# EAGLE design Usb check (EAGLE 9.5.0)

## Sheet 1 of 8
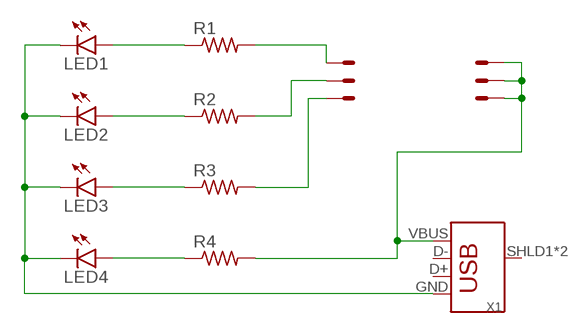
[diagram p0: schematic, sheet 1]

### Parts
LED1  LED5MM  [LED5MM]
LED2  LED5MM  [LED5MM]
LED3  LED5MM  [LED5MM]
LED4  LED5MM  [LED5MM]
R1  R-US_0207/10  [0207/10]
R2  R-US_0207/10  [0207/10]
R3  R-US_0207/10  [0207/10]
R4  R-US_0207/10  [0207/10]
X1  USB_A_PTH_MALE  [USB-A-H]
X2  22-23-2031  [22-23-2031]
X3  22-23-2031  [22-23-2031]

### Nets
GND: LED1.K(C) LED2.K(C) LED3.K(C) LED4.K(C) X1.GND
N$2: LED1.A R1.1
N$3: LED2.A R2.1
N$4: LED3.A R3.1
N$5: LED4.A R4.1
N$6: R1.2 X2.1
N$7: R2.2 X2.2
N$8: R3.2 X2.3
N$9: R4.2 X1.VBUS X3.1 X3.2 X3.3
Unconnected: X1.D+ X1.D- X1.SHLD1(SHIELD) X1.SHLD2(SHIELD)

## Sheet 2 of 8
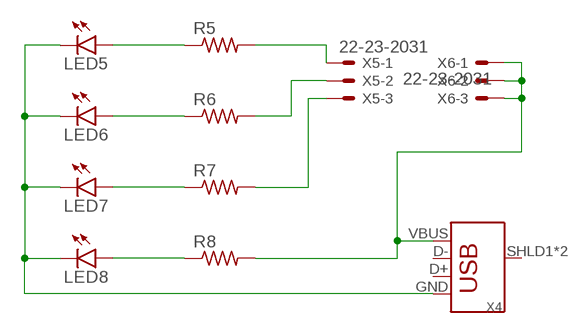
[diagram p1: schematic, sheet 2]

### Parts
LED5  LED5MM  [LED5MM]
LED6  LED5MM  [LED5MM]
LED7  LED5MM  [LED5MM]
LED8  LED5MM  [LED5MM]
R5  R-US_0207/10  [0207/10]
R6  R-US_0207/10  [0207/10]
R7  R-US_0207/10  [0207/10]
R8  R-US_0207/10  [0207/10]
X4  USB_A_PTH_MALE  [USB-A-H]
X5  22-23-2031  [22-23-2031]
X6  22-23-2031  [22-23-2031]

### Nets
GND1: LED5.K(C) LED6.K(C) LED7.K(C) LED8.K(C) X4.GND
N$1: LED5.A R5.1
N$10: LED6.A R6.1
N$11: LED7.A R7.1
N$12: LED8.A R8.1
N$13: R5.2 X5.1
N$14: R6.2 X5.2
N$15: R7.2 X5.3
N$16: R8.2 X4.VBUS X6.1 X6.2 X6.3
Unconnected: X4.D+ X4.D- X4.SHLD1(SHIELD) X4.SHLD2(SHIELD)

## Sheet 3 of 8
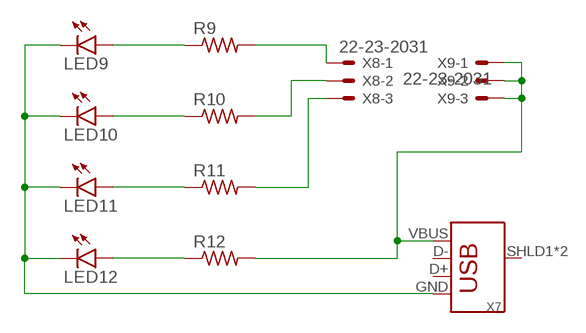
[diagram p2: schematic, sheet 3]

### Parts
LED9  LED5MM  [LED5MM]
LED10  LED5MM  [LED5MM]
LED11  LED5MM  [LED5MM]
LED12  LED5MM  [LED5MM]
R9  R-US_0207/10  [0207/10]
R10  R-US_0207/10  [0207/10]
R11  R-US_0207/10  [0207/10]
R12  R-US_0207/10  [0207/10]
X7  USB_A_PTH_MALE  [USB-A-H]
X8  22-23-2031  [22-23-2031]
X9  22-23-2031  [22-23-2031]

### Nets
GND2: LED9.K(C) LED10.K(C) LED11.K(C) LED12.K(C) X7.GND
N$17: LED9.A R9.1
N$18: LED10.A R10.1
N$19: LED11.A R11.1
N$20: LED12.A R12.1
N$21: R9.2 X8.1
N$22: R10.2 X8.2
N$23: R11.2 X8.3
N$24: R12.2 X7.VBUS X9.1 X9.2 X9.3
Unconnected: X7.D+ X7.D- X7.SHLD1(SHIELD) X7.SHLD2(SHIELD)

## Sheet 4 of 8
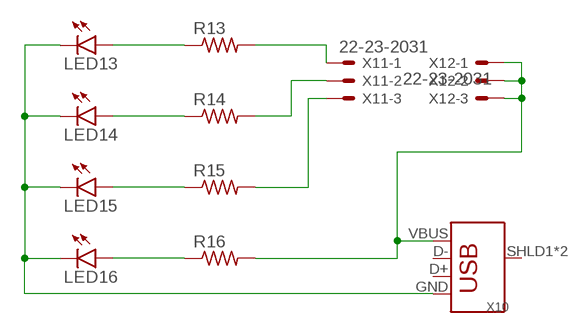
[diagram p3: schematic, sheet 4]

### Parts
LED13  LED5MM  [LED5MM]
LED14  LED5MM  [LED5MM]
LED15  LED5MM  [LED5MM]
LED16  LED5MM  [LED5MM]
R13  R-US_0207/10  [0207/10]
R14  R-US_0207/10  [0207/10]
R15  R-US_0207/10  [0207/10]
R16  R-US_0207/10  [0207/10]
X10  USB_A_PTH_MALE  [USB-A-H]
X11  22-23-2031  [22-23-2031]
X12  22-23-2031  [22-23-2031]

### Nets
GND3: LED13.K(C) LED14.K(C) LED15.K(C) LED16.K(C) X10.GND
N$25: LED13.A R13.1
N$26: LED14.A R14.1
N$27: LED15.A R15.1
N$28: LED16.A R16.1
N$29: R13.2 X11.1
N$30: R14.2 X11.2
N$31: R15.2 X11.3
N$32: R16.2 X10.VBUS X12.1 X12.2 X12.3
Unconnected: X10.D+ X10.D- X10.SHLD1(SHIELD) X10.SHLD2(SHIELD)

## Sheet 5 of 8
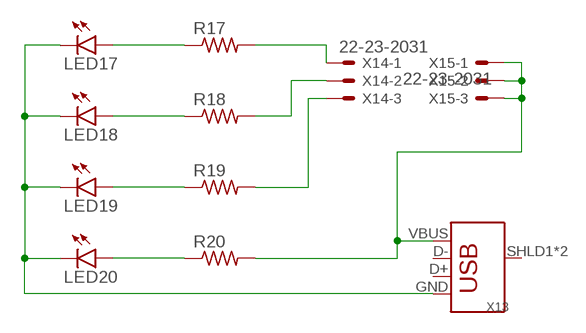
[diagram p4: schematic, sheet 5]

### Parts
LED17  LED5MM  [LED5MM]
LED18  LED5MM  [LED5MM]
LED19  LED5MM  [LED5MM]
LED20  LED5MM  [LED5MM]
R17  R-US_0207/10  [0207/10]
R18  R-US_0207/10  [0207/10]
R19  R-US_0207/10  [0207/10]
R20  R-US_0207/10  [0207/10]
X13  USB_A_PTH_MALE  [USB-A-H]
X14  22-23-2031  [22-23-2031]
X15  22-23-2031  [22-23-2031]

### Nets
GND4: LED17.K(C) LED18.K(C) LED19.K(C) LED20.K(C) X13.GND
N$33: LED17.A R17.1
N$34: LED18.A R18.1
N$35: LED19.A R19.1
N$36: LED20.A R20.1
N$37: R17.2 X14.1
N$38: R18.2 X14.2
N$39: R19.2 X14.3
N$40: R20.2 X13.VBUS X15.1 X15.2 X15.3
Unconnected: X13.D+ X13.D- X13.SHLD1(SHIELD) X13.SHLD2(SHIELD)

## Sheet 6 of 8
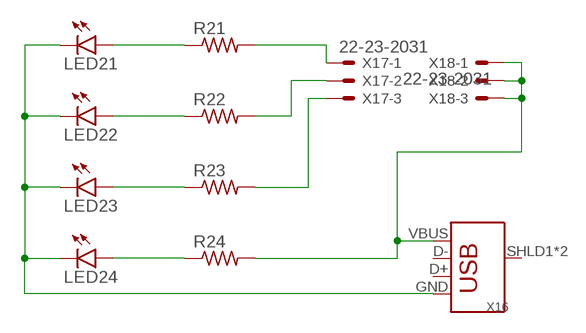
[diagram p5: schematic, sheet 6]

### Parts
LED21  LED5MM  [LED5MM]
LED22  LED5MM  [LED5MM]
LED23  LED5MM  [LED5MM]
LED24  LED5MM  [LED5MM]
R21  R-US_0207/10  [0207/10]
R22  R-US_0207/10  [0207/10]
R23  R-US_0207/10  [0207/10]
R24  R-US_0207/10  [0207/10]
X16  USB_A_PTH_MALE  [USB-A-H]
X17  22-23-2031  [22-23-2031]
X18  22-23-2031  [22-23-2031]

### Nets
GND5: LED21.K(C) LED22.K(C) LED23.K(C) LED24.K(C) X16.GND
N$41: LED21.A R21.1
N$42: LED22.A R22.1
N$43: LED23.A R23.1
N$44: LED24.A R24.1
N$45: R21.2 X17.1
N$46: R22.2 X17.2
N$47: R23.2 X17.3
N$48: R24.2 X16.VBUS X18.1 X18.2 X18.3
Unconnected: X16.D+ X16.D- X16.SHLD1(SHIELD) X16.SHLD2(SHIELD)

## Sheet 7 of 8
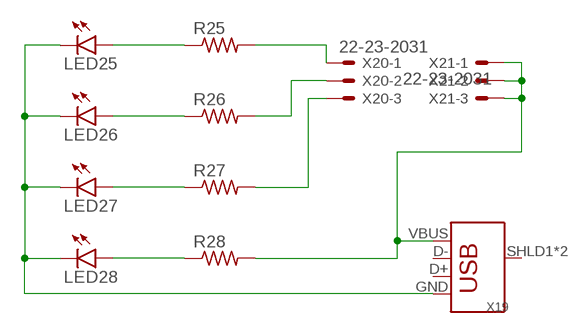
[diagram p6: schematic, sheet 7]

### Parts
LED25  LED5MM  [LED5MM]
LED26  LED5MM  [LED5MM]
LED27  LED5MM  [LED5MM]
LED28  LED5MM  [LED5MM]
R25  R-US_0207/10  [0207/10]
R26  R-US_0207/10  [0207/10]
R27  R-US_0207/10  [0207/10]
R28  R-US_0207/10  [0207/10]
X19  USB_A_PTH_MALE  [USB-A-H]
X20  22-23-2031  [22-23-2031]
X21  22-23-2031  [22-23-2031]

### Nets
GND6: LED25.K(C) LED26.K(C) LED27.K(C) LED28.K(C) X19.GND
N$49: LED25.A R25.1
N$50: LED26.A R26.1
N$51: LED27.A R27.1
N$52: LED28.A R28.1
N$53: R25.2 X20.1
N$54: R26.2 X20.2
N$55: R27.2 X20.3
N$56: R28.2 X19.VBUS X21.1 X21.2 X21.3
Unconnected: X19.D+ X19.D- X19.SHLD1(SHIELD) X19.SHLD2(SHIELD)

## Sheet 8 of 8
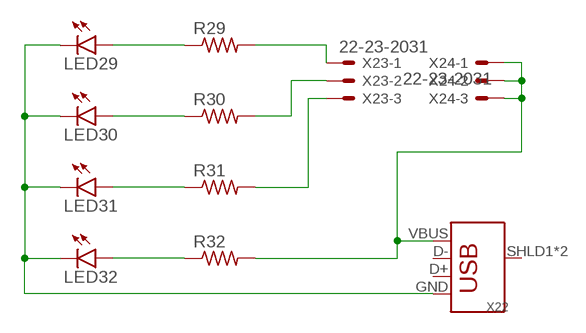
[diagram p7: schematic, sheet 8]

### Parts
LED29  LED5MM  [LED5MM]
LED30  LED5MM  [LED5MM]
LED31  LED5MM  [LED5MM]
LED32  LED5MM  [LED5MM]
R29  R-US_0207/10  [0207/10]
R30  R-US_0207/10  [0207/10]
R31  R-US_0207/10  [0207/10]
R32  R-US_0207/10  [0207/10]
X22  USB_A_PTH_MALE  [USB-A-H]
X23  22-23-2031  [22-23-2031]
X24  22-23-2031  [22-23-2031]

### Nets
GND7: LED29.K(C) LED30.K(C) LED31.K(C) LED32.K(C) X22.GND
N$57: LED29.A R29.1
N$58: LED30.A R30.1
N$59: LED31.A R31.1
N$60: LED32.A R32.1
N$61: R29.2 X23.1
N$62: R30.2 X23.2
N$63: R31.2 X23.3
N$64: R32.2 X22.VBUS X24.1 X24.2 X24.3
Unconnected: X22.D+ X22.D- X22.SHLD1(SHIELD) X22.SHLD2(SHIELD)

## Library data of the parts
LED1-LED32 = led:LED: LED OSRAM: - CHIPLED LG R971, LG N971, LY N971, LG Q971, LY Q971, LO R971, LY R971 LH N974, LH R974 LS Q976, LO Q976, LY Q976 LO Q996 - Hyper CHIPLED LW Q18S LB Q993, LB Q99A, LB R99A - SideLED LS A670, LO A670, LY A670, LG A670, LP A670 LB A673, LV A673, LT A673, LW A673 LH A674 LY A675 LS A676, LA A676, LO A676, LY A676, LW A676 LS A679, LY A679, LG A679 - Hyper Micro SIDELED® LS Y876, LA Y876, LO Y876, LY Y876 LT Y87S - SmartLED LW L88C, LW L88S LB L89C, LB L89S, LG L890 LS L89K, LO L89K, LY L89K LS L896, LA L896, LO L896, LY L896 - TOPLED LS T670, LO T670, LY T670, LG T670, LP T670 LSG T670, LSP T670, LSY T670, LOP T670, LYG T670 LG T671, LOG T671, LSG T671 LB T673, LV T673, LT T673, LW T673 LH T674 LS T676, LA T676, LO T676, LY T676, LB T676, LH T676, LSB T676, LW T676 LB T67C, LV T67C, LT T67C, LS T67K, LO T67K, LY T67K, LW E67C LS E67B, LA E67B, LO E67B, LY E67B, LB E67C, LV E67C, LT E67C LW T67C LS T679, LY T679, LG T679 LS T770, LO T770, LY T770, LG T770, LP T770 LB T773, LV T773, LT T773, LW T773 LH T774 LS E675, LA E675, LY E675, LS T675 LS T776, LA T776, LO T776, LY T776, LB T776 LHGB T686 LT T68C, LB T68C - Hyper Mini TOPLED® LB M676 - Mini TOPLED Santana® LG M470 LS M47K, LO M47K, LY M47K Source: http://www.osram.convergy.de LUXEON: - LUMILED® LXK2-PW12-R00, LXK2-PW12-S00, LXK2-PW14-U00, LXK2-PW14-V00 LXK2-PM12-R00, LXK2-PM12-S00, LXK2-PM14-U00 LXK2-PE12-Q00, LXK2-PE12-R00, LXK2-PE12-S00, LXK2-PE14-T00, LXK2-PE14-U00 LXK2-PB12-K00, LXK2-PB12-L00, LXK2-PB12-M00, LXK2-PB14-N00, LXK2-PB14-P00, LXK2-PB14-Q00 LXK2-PR12-L00, LXK2-PR12-M00, LXK2-PR14-Q00, LXK2-PR14-R00 LXK2-PD12-Q00, LXK2-PD12-R00, LXK2-PD12-S00 LXK2-PH12-R00, LXK2-PH12-S00 LXK2-PL12-P00, LXK2-PL12-Q00, LXK2-PL12-R00 Source: www.luxeon.com KINGBRIGHT: KA-3528ASYC Source: www.kingbright.com
R1-R32 = rcl:R-US_: RESISTOR, American symbol; SPICEPREFIX: R
X1 X4 X7 X10 X13 X16 X19 X22 = SparkFun-Connectors:USB_A: USB-A Connector Male and female variants, as well as PTH and SMT variants SparkFun Products: SparkFun XBee Explorer Dongle <https://www.sparkfun.com/products/11697> PTH Male SparkFun MicroView-USB Programmer <https://www.sparkfun.com/products/12924> SMT Male SparkFun USB Type A Female Breakout <https://www.sparkfun.com/products/12700> SMT Female; PROD_ID: CONN-08367; SF_ID: PRT-00437
X2 X3 X5 X6 X8 X9 X11 X12 X14 X15 X17 X18 X20 X21 X23 X24 = con-molex:22-23-2031: .100" (2.54mm) Center Header - 3 Pin; MF: MOLEX; MPN: 22-23-2031; OC_FARNELL: 1462950; OC_NEWARK: 30C0862

## Board
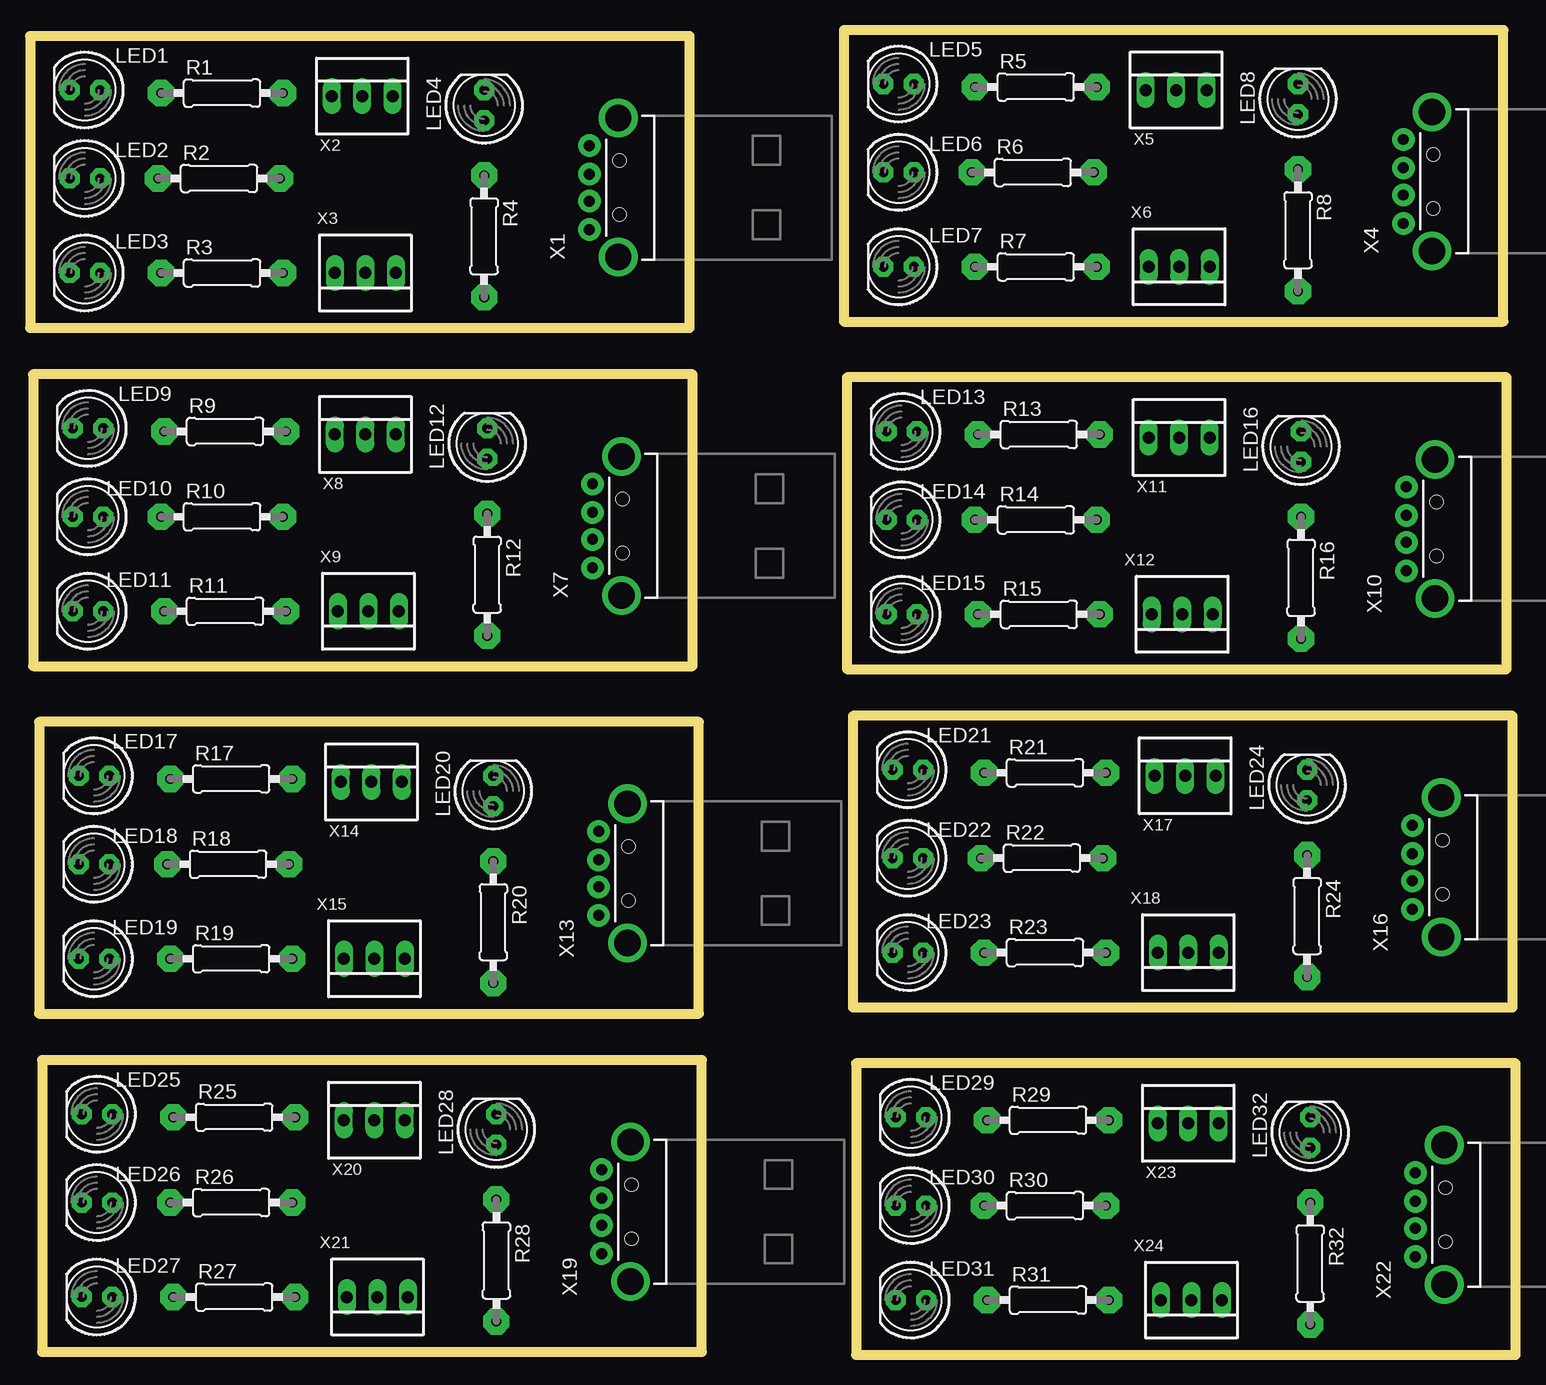
[diagram p8: board, top side]
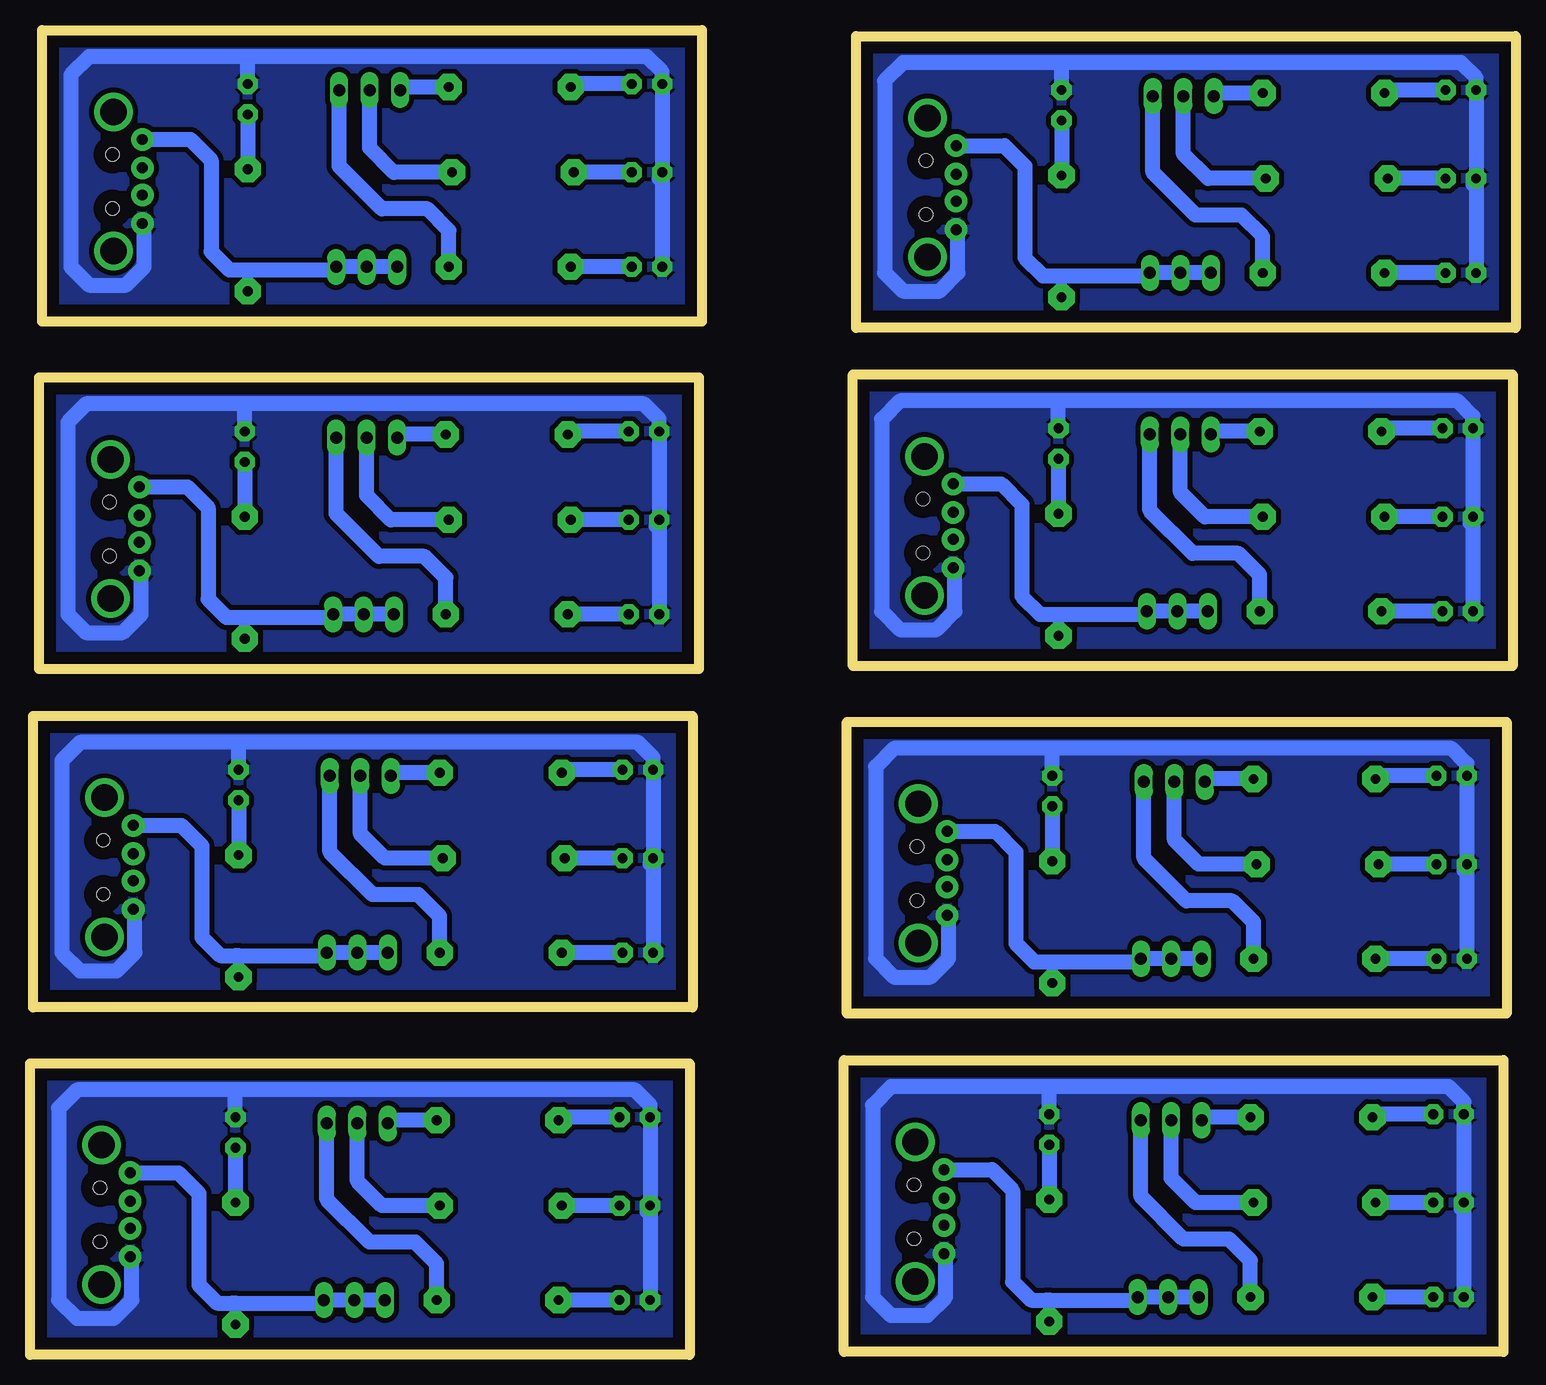
[diagram p9: board, bottom side, seen from below]

Size 123.8 x 110.41 mm. Coordinates in mm from the lower left corner, seen from the top.
Outline: 0,85.6 54.97,85.6 54.97,109.91 0,109.91 0,85.6
Outline: 67.82,86.11 122.79,86.11 122.79,110.41 67.82,110.41 67.82,86.11
Outline: 0.25,57.4 55.23,57.4 55.23,81.71 0.25,81.71 0.25,57.4
Outline: 68.07,57.15 123.04,57.15 123.04,81.46 68.07,81.46 68.07,57.15
Outline: 0.76,28.45 55.73,28.45 55.73,52.76 0.76,52.76 0.76,28.45
Outline: 68.58,28.96 123.55,28.96 123.55,53.26 68.58,53.26 68.58,28.96
Outline: 1.02,0.25 55.99,0.25 55.99,24.56 1.02,24.56 1.02,0.25
Outline: 68.83,0 123.8,0 123.8,24.31 68.83,24.31 68.83,0
Copper layers (1*16): Top 0.035mm / dielectric 1.5mm / Bottom 0.035mm
Design rules "default": minimum track width 6mil, minimum drill 0.35mm, track to track 6mil, track to pad 6mil, pad to pad 6mil, via to via 6mil, smd to smd 6mil, copper to edge 40mil, drill to drill 6mil, minimum pad ring 10mil, minimum via ring 8mil, stop-mask expansion 4mil, vias tented up to drill 0mil, thermal gap 10mil

### Footprints (pad centres in the part's own frame; a part is rotated, then mirrored left to right if it is on the bottom)
LED5MM = drill 0.813 pad 1.676 octagon: A -1.27,0; K 1.27,0
0207/10 = drill 0.813 pad 2.184 octagon: 1 -5.08,0; 2 5.08,0
USB-A-H = drill 0.914 pad 1.88: D+ 2.4,1.127; D- 2.4,-1.127; GND 2.4,3.5; VBUS 2.4,-3.5 | drill 2.2: SHLD1 0,-5.8; SHLD2 0,5.8 | hole 1.1: -0.1,2.25; -0.1,-2.25
22-23-2031 = drill 1 long: 1 -2.54,0; 2 0,0; 3 2.54,0

### Placement (x,y rotation side)
LED1  4.57,105.41 180 top
LED2  4.57,98.04 180 top
LED3  4.57,90.17 180 top
LED4  37.85,104.14 90 top
LED5  72.39,105.92 180 top
LED6  72.39,98.55 180 top
LED7  72.39,90.68 180 top
LED8  105.66,104.65 90 top
LED9  4.83,77.22 180 top
LED10  4.83,69.85 180 top
LED11  4.83,61.98 180 top
LED12  38.1,75.95 90 top
LED13  72.64,76.96 180 top
LED14  72.64,69.6 180 top
LED15  72.64,61.72 180 top
LED16  105.92,75.69 90 top
LED17  5.33,48.26 180 top
LED18  5.33,40.89 180 top
LED19  5.33,33.02 180 top
LED20  38.61,46.99 90 top
LED21  73.15,48.77 180 top
LED22  73.15,41.4 180 top
LED23  73.15,33.53 180 top
LED24  106.43,47.5 90 top
LED25  5.59,20.07 180 top
LED26  5.59,12.7 180 top
LED27  5.59,4.83 180 top
LED28  38.86,18.8 90 top
LED29  73.41,19.81 180 top
LED30  73.41,12.45 180 top
LED31  73.41,4.57 180 top
LED32  106.68,18.54 90 top
R1  16,105.16 0 top
R2  15.75,98.04 0 top
R3  16,90.17 0 top
R4  37.85,93.22 270 top
R5  83.82,105.66 0 top
R6  83.57,98.55 0 top
R7  83.82,90.68 0 top
R8  105.66,93.73 270 top
R9  16.26,76.96 0 top
R10  16,69.85 0 top
R11  16.26,61.98 0 top
R12  38.1,65.02 270 top
R13  84.07,76.71 0 top
R14  83.82,69.6 0 top
R15  84.07,61.72 0 top
R16  105.92,64.77 270 top
R17  16.76,48.01 0 top
R18  16.51,40.89 0 top
R19  16.76,33.02 0 top
R20  38.61,36.07 270 top
R21  84.58,48.51 0 top
R22  84.33,41.4 0 top
R23  84.58,33.53 0 top
R24  106.43,36.58 270 top
R25  17.02,19.81 0 top
R26  16.76,12.7 0 top
R27  17.02,4.83 0 top
R28  38.86,7.87 270 top
R29  84.84,19.56 0 top
R30  84.58,12.45 0 top
R31  84.84,4.57 0 top
R32  106.68,7.62 270 top
X1  49.02,97.28 180 top
X2  27.69,104.9 0 top
X3  27.94,90.17 180 top
X4  116.84,97.79 180 top
X5  95.5,105.41 0 top
X6  95.76,90.68 180 top
X7  49.28,69.09 180 top
X8  27.94,76.71 0 top
X9  28.19,61.98 180 top
X10  117.09,68.83 180 top
X11  95.76,76.45 0 top
X12  96.01,61.72 180 top
X13  49.78,40.13 180 top
X14  28.45,47.75 0 top
X15  28.7,33.02 180 top
X16  117.6,40.64 180 top
X17  96.27,48.26 0 top
X18  96.52,33.53 180 top
X19  50.04,11.94 180 top
X20  28.7,19.56 0 top
X21  28.96,4.83 180 top
X22  117.86,11.68 180 top
X23  96.52,19.3 0 top
X24  96.77,4.57 180 top

### Tracks (layer width: path | path; a pad name or v marks a point on that pad's centre or on a via)
GND
  Bottom 1.27: LED4.K 37.85,107.7 | 3.56,97.54 3.3,97.54 LED1.K 3.3,106.43 4.57,107.7 37.85,107.7 | LED2.K LED3.K | X1.GND 46.48,93.64 46.48,90.17 48.01,88.65 51.05,88.65 52.58,90.17 52.58,106.17 51.05,107.7 37.85,107.7
  pour Bottom (isolate 0.406): 0.76,109.22 54.1,109.22 54.1,86.61 0.76,86.61
GND1
  Bottom 1.27: LED8.K 105.66,108.2 | 71.37,98.04 71.12,98.04 LED5.K 71.12,106.93 72.39,108.2 105.66,108.2 | LED6.K LED7.K | X4.GND 114.3,94.15 114.3,90.68 115.82,89.15 118.87,89.15 120.4,90.68 120.4,106.68 118.87,108.2 105.66,108.2
  pour Bottom (isolate 0.406): 68.58,109.73 121.92,109.73 121.92,87.12 68.58,87.12
GND2
  Bottom 1.27: LED12.K 38.1,79.5 | 3.81,69.34 3.56,69.34 LED9.K 3.56,78.23 4.83,79.5 38.1,79.5 | LED10.K LED11.K | X7.GND 46.74,65.45 46.74,61.98 48.26,60.45 51.31,60.45 52.83,61.98 52.83,77.98 51.31,79.5 38.1,79.5
  pour Bottom (isolate 0.406): 1.02,81.03 54.36,81.03 54.36,58.42 1.02,58.42
GND3
  Bottom 1.27: LED16.K 105.92,79.25 | 71.63,69.09 71.37,69.09 LED13.K 71.37,77.98 72.64,79.25 105.92,79.25 | LED14.K LED15.K | X10.GND 114.55,65.19 114.55,61.72 116.08,60.2 119.13,60.2 120.65,61.72 120.65,77.72 119.13,79.25 105.92,79.25
  pour Bottom (isolate 0.406): 68.83,80.77 122.17,80.77 122.17,58.17 68.83,58.17
GND4
  Bottom 1.27: LED20.K 38.61,50.55 | 4.32,40.39 4.06,40.39 LED17.K 4.06,49.28 5.33,50.55 38.61,50.55 | LED18.K LED19.K | X13.GND 47.24,36.49 47.24,33.02 48.77,31.5 51.82,31.5 53.34,33.02 53.34,49.02 51.82,50.55 38.61,50.55
  pour Bottom (isolate 0.406): 1.52,52.07 54.86,52.07 54.86,29.46 1.52,29.46
GND5
  Bottom 1.27: LED24.K 106.43,51.05 | 72.14,40.89 71.88,40.89 LED21.K 71.88,49.78 73.15,51.05 106.43,51.05 | LED22.K LED23.K | X16.GND 115.06,37 115.06,33.53 116.59,32 119.63,32 121.16,33.53 121.16,49.53 119.63,51.05 106.43,51.05
  pour Bottom (isolate 0.406): 69.34,52.58 122.68,52.58 122.68,29.97 69.34,29.97
GND6
  Bottom 1.27: LED28.K 38.86,22.35 | 4.57,12.19 4.32,12.19 LED25.K 4.32,21.08 5.59,22.35 38.86,22.35 | LED26.K LED27.K | X19.GND 47.5,8.3 47.5,4.83 49.02,3.3 52.07,3.3 53.59,4.83 53.59,20.83 52.07,22.35 38.86,22.35
  pour Bottom (isolate 0.406): 1.78,23.88 55.12,23.88 55.12,1.27 1.78,1.27
GND7
  Bottom 1.27: LED32.K 106.68,22.1 | 72.39,11.94 72.14,11.94 LED29.K 72.14,20.83 73.41,22.1 106.68,22.1 | LED30.K LED31.K | X22.GND 115.32,8.04 115.32,4.57 116.84,3.05 119.89,3.05 121.41,4.57 121.41,20.57 119.89,22.1 106.68,22.1
  pour Bottom (isolate 0.406): 69.6,23.62 122.94,23.62 122.94,1.02 69.6,1.02
N$1
  Bottom 1.27: LED5.A 78.49,105.92 R5.1
N$2
  Bottom 1.27: LED1.A 10.67,105.41 R1.1
N$3
  Bottom 1.27: LED2.A R2.1
N$4
  Bottom 1.27: LED3.A R3.1
N$5
  Bottom 1.27: LED4.A R4.1
N$6
  Bottom 1.27: R1.2 24.89,105.16 X2.1
N$7
  Bottom 1.27: R2.2 25.65,98.04 27.69,100.08 X2.2
N$8
  Bottom 1.27: R3.2 21.08,93.22 22.86,95 26.67,95 30.23,98.55 X2.3
N$9
  Bottom 0.813: 37.85,89.66 R4.2
  Bottom 1.27: X3.3 X3.2 X3.1 30.73,89.92 37.85,89.92 38.1,89.92 | 38.1,89.92 37.85,89.66 | X1.VBUS 42.62,100.78 40.89,99.06 40.89,91.44 39.37,89.92 38.1,89.92
N$10
  Bottom 1.27: LED6.A R6.1
N$11
  Bottom 1.27: LED7.A R7.1
N$12
  Bottom 1.27: LED8.A R8.1
N$13
  Bottom 1.27: R5.2 92.71,105.66 X5.1
N$14
  Bottom 1.27: R6.2 93.47,98.55 95.5,100.58 X5.2
N$15
  Bottom 1.27: R7.2 88.9,93.73 90.68,95.5 94.49,95.5 98.04,99.06 X5.3
N$16
  Bottom 0.813: R8.2 105.66,90.42
  Bottom 1.27: X6.3 X6.2 X6.1 98.55,90.42 105.66,90.42 105.92,90.42 | 105.66,90.17 105.92,90.42 | X4.VBUS 110.43,101.29 108.71,99.57 108.71,91.95 107.19,90.42 105.92,90.42
N$17
  Bottom 1.27: LED9.A 10.92,77.22 R9.1
N$18
  Bottom 1.27: LED10.A R10.1
N$19
  Bottom 1.27: LED11.A R11.1
N$20
  Bottom 1.27: LED12.A R12.1
N$21
  Bottom 1.27: R9.2 25.15,76.96 X8.1
N$22
  Bottom 1.27: R10.2 25.91,69.85 27.94,71.88 X8.2
N$23
  Bottom 1.27: R11.2 21.34,65.02 23.11,66.8 26.92,66.8 30.48,70.36 X8.3
N$24
  Bottom 0.813: 38.1,61.47 R12.2
  Bottom 1.27: X9.3 X9.2 X9.1 30.99,61.72 38.1,61.72 38.35,61.72 | 38.35,61.72 38.1,61.47 | X7.VBUS 42.87,72.59 41.15,70.87 41.15,63.25 39.62,61.72 38.35,61.72
N$25
  Bottom 1.27: LED13.A 78.74,76.96 R13.1
N$26
  Bottom 1.27: LED14.A R14.1
N$27
  Bottom 1.27: LED15.A R15.1
N$28
  Bottom 1.27: LED16.A R16.1
N$29
  Bottom 1.27: R13.2 92.96,76.71 X11.1
N$30
  Bottom 1.27: R14.2 93.73,69.6 95.76,71.63 X11.2
N$31
  Bottom 1.27: R15.2 89.15,64.77 90.93,66.55 94.74,66.55 98.3,70.1 X11.3
N$32
  Bottom 0.813: R16.2 105.92,61.21
  Bottom 1.27: X12.3 X12.2 X12.1 98.81,61.47 105.92,61.47 106.17,61.47 | 105.92,61.21 106.17,61.47 | X10.VBUS 110.69,72.33 108.97,70.61 108.97,62.99 107.44,61.47 106.17,61.47
N$33
  Bottom 1.27: LED17.A 11.43,48.26 R17.1
N$34
  Bottom 1.27: LED18.A R18.1
N$35
  Bottom 1.27: LED19.A R19.1
N$36
  Bottom 1.27: LED20.A R20.1
N$37
  Bottom 1.27: R17.2 25.65,48.01 X14.1
N$38
  Bottom 1.27: R18.2 26.42,40.89 28.45,42.93 X14.2
N$39
  Bottom 1.27: R19.2 21.84,36.07 23.62,37.85 27.43,37.85 30.99,41.4 X14.3
N$40
  Bottom 0.813: 38.61,32.51 R20.2
  Bottom 1.27: X15.3 X15.2 X15.1 31.5,32.77 38.61,32.77 38.86,32.77 | 38.86,32.77 38.61,32.51 | X13.VBUS 43.38,43.63 41.66,41.91 41.66,34.29 40.13,32.77 38.86,32.77
N$41
  Bottom 1.27: LED21.A 79.25,48.77 R21.1
N$42
  Bottom 1.27: LED22.A R22.1
N$43
  Bottom 1.27: LED23.A R23.1
N$44
  Bottom 1.27: LED24.A R24.1
N$45
  Bottom 1.27: R21.2 93.47,48.51 X17.1
N$46
  Bottom 1.27: R22.2 94.23,41.4 96.27,43.43 X17.2
N$47
  Bottom 1.27: R23.2 89.66,36.58 91.44,38.35 95.25,38.35 98.81,41.91 X17.3
N$48
  Bottom 0.813: R24.2 106.43,33.27
  Bottom 1.27: X18.3 X18.2 X18.1 99.31,33.27 106.43,33.27 106.68,33.27 | 106.43,33.02 106.68,33.27 | X16.VBUS 111.2,44.14 109.47,42.42 109.47,34.8 107.95,33.27 106.68,33.27
N$49
  Bottom 1.27: LED25.A 11.68,20.07 R25.1
N$50
  Bottom 1.27: LED26.A R26.1
N$51
  Bottom 1.27: LED27.A R27.1
N$52
  Bottom 1.27: LED28.A R28.1
N$53
  Bottom 1.27: R25.2 25.91,19.81 X20.1
N$54
  Bottom 1.27: R26.2 26.67,12.7 28.7,14.73 X20.2
N$55
  Bottom 1.27: R27.2 22.1,7.87 23.88,9.65 27.69,9.65 31.24,13.21 X20.3
N$56
  Bottom 0.813: 38.86,4.32 R28.2
  Bottom 1.27: X21.3 X21.2 X21.1 31.75,4.57 38.86,4.57 39.12,4.57 | 39.12,4.57 38.86,4.32 | X19.VBUS 43.63,15.44 41.91,13.72 41.91,6.1 40.39,4.57 39.12,4.57
N$57
  Bottom 1.27: LED29.A 79.5,19.81 R29.1
N$58
  Bottom 1.27: LED30.A R30.1
N$59
  Bottom 1.27: LED31.A R31.1
N$60
  Bottom 1.27: LED32.A R32.1
N$61
  Bottom 1.27: R29.2 93.73,19.56 X23.1
N$62
  Bottom 1.27: R30.2 94.49,12.45 96.52,14.48 X23.2
N$63
  Bottom 1.27: R31.2 89.92,7.62 91.69,9.4 95.5,9.4 99.06,12.95 X23.3
N$64
  Bottom 0.813: R32.2 106.68,4.06
  Bottom 1.27: X24.3 X24.2 X24.1 99.57,4.32 106.68,4.32 106.93,4.32 | 106.68,4.06 106.93,4.32 | X22.VBUS 111.45,15.18 109.73,13.46 109.73,5.84 108.2,4.32 106.93,4.32